# EAGLE design BL600CommunicationBoard (EAGLE 7.3.0)
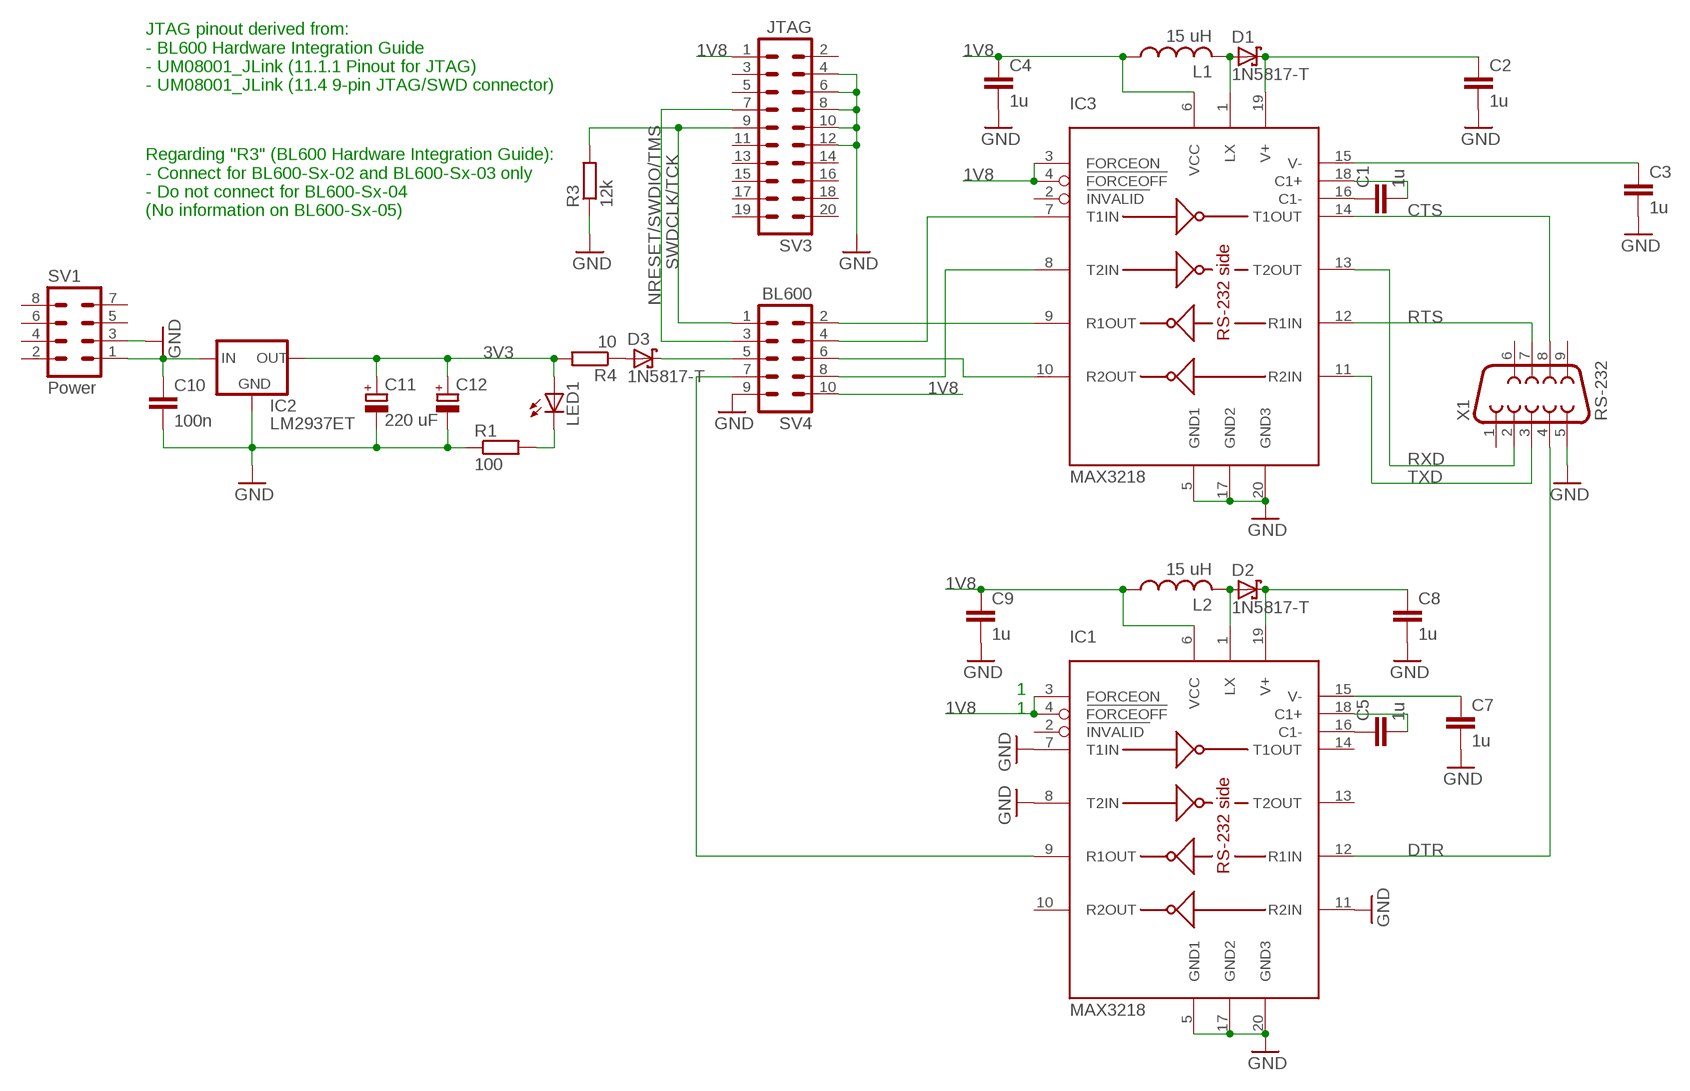
[diagram p0: schematic, sheet 1]

## Parts
C1  1u  C-EU050-025X075  [C050-025X075]
C2  1u  C-EU050-025X075  [C050-025X075]
C3  1u  C-EU050-025X075  [C050-025X075]
C4  1u  C-EU050-025X075  [C050-025X075]
C5  1u  C-EU050-025X075  [C050-025X075]
C7  1u  C-EU050-025X075  [C050-025X075]
C8  1u  C-EU050-025X075  [C050-025X075]
C9  1u  C-EU050-025X075  [C050-025X075]
C10  100n  C-EU050-025X075  [C050-025X075]
C11  220 uF  CPOL-EUE2.5-6  [E2,5-6]
C12  CPOL-EUE3.5-8  [E3,5-8]
D1  1N5817-T  [DO41-7.6]
D2  1N5817-T  [DO41-7.6]
D3  1N5817-T  [DO41-7.6]
IC1  MAX3218  [DIL20]
IC2  LM2937ET  78XXS  [78XXS]
IC3  MAX3218  [DIL20]
L1  15 uH  L-USL1812  [L1812]
L2  15 uH  L-USL1812  [L1812]
LED1  LED3MM  [LED3MM]
R1  100  R-EU_0207/10  [0207/10]
R3  12k  R-EU_0207/10  [0207/10]
R4  10  R-EU_0207/10  [0207/10]
SV1  Power  MA04-2  [MA04-2]
SV3  JTAG  MA10-2  [MA10-2]
SV4  BL600  MA05-2  [MA05-2]
X1  RS-232  F09VP  [F09VP]

## Nets
1V8: C4.1 C9.1 IC1.3(FORCEON) IC1.4(FORCEOFF) IC1.6(VCC) IC3.3(FORCEON) IC3.4(FORCEOFF) IC3.6(VCC) L1.1 L2.1 SV3.1 SV4.10
3V3: C11.+ C12.+ IC2.OUT LED1.A R4.2
CTS: IC3.14(T1OUT) X1.8
DTR: IC1.12(R1IN) X1.4
GND: C2.2 C3.2 C4.2 C7.2 C8.2 C9.2 C10.2 C11.- C12.- IC1.5(GND1) IC1.7(T1IN) IC1.8(T2IN) IC1.11(R2IN) IC1.17(GND2) IC1.20(GND3) IC2.GND IC3.5(GND1) IC3.17(GND2) IC3.20(GND3) R1.1 R3.1 SV1.3 SV3.4 SV3.6 SV3.8 SV3.10 SV3.12 SV4.9 X1.5
N$1: C10.1 IC2.IN SV1.1
N$2: IC3.8(T2IN) SV4.8
N$3: IC3.7(T1IN) SV4.4
N$4: IC3.9(R1OUT) SV4.2
N$5: IC3.10(R2OUT) SV4.6
N$6: D3.A R4.1
N$7: D3.C SV4.5
N$8: D1.A IC3.1(LX) L1.2
N$9: C2.1 D1.C IC3.19(V+)
N$10: C3.1 IC3.15(V-)
N$11: C1.1 IC3.16(C1-)
N$12: C1.2 IC3.18(C1+)
N$16: D2.A IC1.1(LX) L2.2
N$18: LED1.K(C) R1.2
N$19: C8.1 D2.C IC1.19(V+)
N$21: C5.1 IC1.16(C1-)
N$22: C5.2 IC1.18(C1+)
N$23: C7.1 IC1.15(V-)
N$24: IC1.9(R1OUT) SV4.7
NRESET/SWDIO/TMS: SV3.7 SV4.3
RTS: IC3.12(R1IN) X1.7
RXD: IC3.13(T2OUT) X1.2
SWDCLK/TCK: R3.2 SV3.9 SV4.1
TXD: IC3.11(R2IN) X1.3
Unconnected: IC1.2(INVALID) IC1.10(R2OUT) IC1.13(T2OUT) IC1.14(T1OUT) IC3.2(INVALID) SV1.2 SV1.4 SV1.5 SV1.6 SV1.7 SV1.8 SV3.2 SV3.3 SV3.5 SV3.11 SV3.13 SV3.14 SV3.15 SV3.16 SV3.17 SV3.18 SV3.19 SV3.20 X1.1 X1.6 X1.9

## Notes on the sheet
- JTAG pinout derived from:
  - BL600 Hardware Integration Guide
  - UM08001_JLink (11.1.1 Pinout for JTAG)
  - UM08001_JLink (11.4 9-pin JTAG/SWD connector)
- Regarding "R3" (BL600 Hardware Integration Guide):
  - Connect for BL600-Sx-02 and BL600-Sx-03 only
  - Do not connect for BL600-Sx-04
  (No information on BL600-Sx-05)
- 1
  1

## Library data of the parts
C1-C5 C7-C10 = rcl:C-EU: CAPACITOR, European symbol
C11 C12 = rcl:CPOL-EU: POLARIZED CAPACITOR, European symbol
D1-D3 = diode:1N581*: 1.0A SCHOTTKY BARRIER RECTIFIER Source: http://www.diodes.com/datasheets/ds23001.pdf
IC1 IC3 = ulf:MAX3218
IC2 = v-reg:78XXS: VOLTAGE REGULATOR
L1 L2 = rcl:L-US: INDUCTOR, American symbol
LED1 = led:LED: LED OSRAM: - CHIPLED LG R971, LG N971, LY N971, LG Q971, LY Q971, LO R971, LY R971 LH N974, LH R974 LS Q976, LO Q976, LY Q976 LO Q996 - Hyper CHIPLED LW Q18S LB Q993, LB Q99A, LB R99A - SideLED LS A670, LO A670, LY A670, LG A670, LP A670 LB A673, LV A673, LT A673, LW A673 LH A674 LY A675 LS A676, LA A676, LO A676, LY A676, LW A676 LS A679, LY A679, LG A679 - Hyper Micro SIDELED® LS Y876, LA Y876, LO Y876, LY Y876 LT Y87S - SmartLED LW L88C, LW L88S LB L89C, LB L89S, LG L890 LS L89K, LO L89K, LY L89K LS L896, LA L896, LO L896, LY L896 - TOPLED LS T670, LO T670, LY T670, LG T670, LP T670 LSG T670, LSP T670, LSY T670, LOP T670, LYG T670 LG T671, LOG T671, LSG T671 LB T673, LV T673, LT T673, LW T673 LH T674 LS T676, LA T676, LO T676, LY T676, LB T676, LH T676, LSB T676, LW T676 LB T67C, LV T67C, LT T67C, LS T67K, LO T67K, LY T67K, LW E67C LS E67B, LA E67B, LO E67B, LY E67B, LB E67C, LV E67C, LT E67C LW T67C LS T679, LY T679, LG T679 LS T770, LO T770, LY T770, LG T770, LP T770 LB T773, LV T773, LT T773, LW T773 LH T774 LS E675, LA E675, LY E675, LS T675 LS T776, LA T776, LO T776, LY T776, LB T776 LHGB T686 LT T68C, LB T68C - Hyper Mini TOPLED® LB M676 - Mini TOPLED Santana® LG M470 LS M47K, LO M47K, LY M47K Source: http://www.osram.convergy.de LUXEON: - LUMILED® LXK2-PW12-R00, LXK2-PW12-S00, LXK2-PW14-U00, LXK2-PW14-V00 LXK2-PM12-R00, LXK2-PM12-S00, LXK2-PM14-U00 LXK2-PE12-Q00, LXK2-PE12-R00, LXK2-PE12-S00, LXK2-PE14-T00, LXK2-PE14-U00 LXK2-PB12-K00, LXK2-PB12-L00, LXK2-PB12-M00, LXK2-PB14-N00, LXK2-PB14-P00, LXK2-PB14-Q00 LXK2-PR12-L00, LXK2-PR12-M00, LXK2-PR14-Q00, LXK2-PR14-R00 LXK2-PD12-Q00, LXK2-PD12-R00, LXK2-PD12-S00 LXK2-PH12-R00, LXK2-PH12-S00 LXK2-PL12-P00, LXK2-PL12-Q00, LXK2-PL12-R00 Source: www.luxeon.com KINGBRIGHT: KA-3528ASYC Source: www.kingbright.com
R1 R3 R4 = rcl:R-EU_: RESISTOR, European symbol
SV1 = con-lstb:MA04-2: PIN HEADER; OC_FARNELL: unknown; OC_NEWARK: unknown
SV3 = con-lstb:MA10-2: PIN HEADER; OC_FARNELL: unknown; OC_NEWARK: unknown
SV4 = con-lstb:MA05-2: PIN HEADER; OC_FARNELL: unknown; OC_NEWARK: unknown
X1 = con-subd:F09: SUB-D; OC_FARNELL: unknown; OC_NEWARK: unknown

## Board
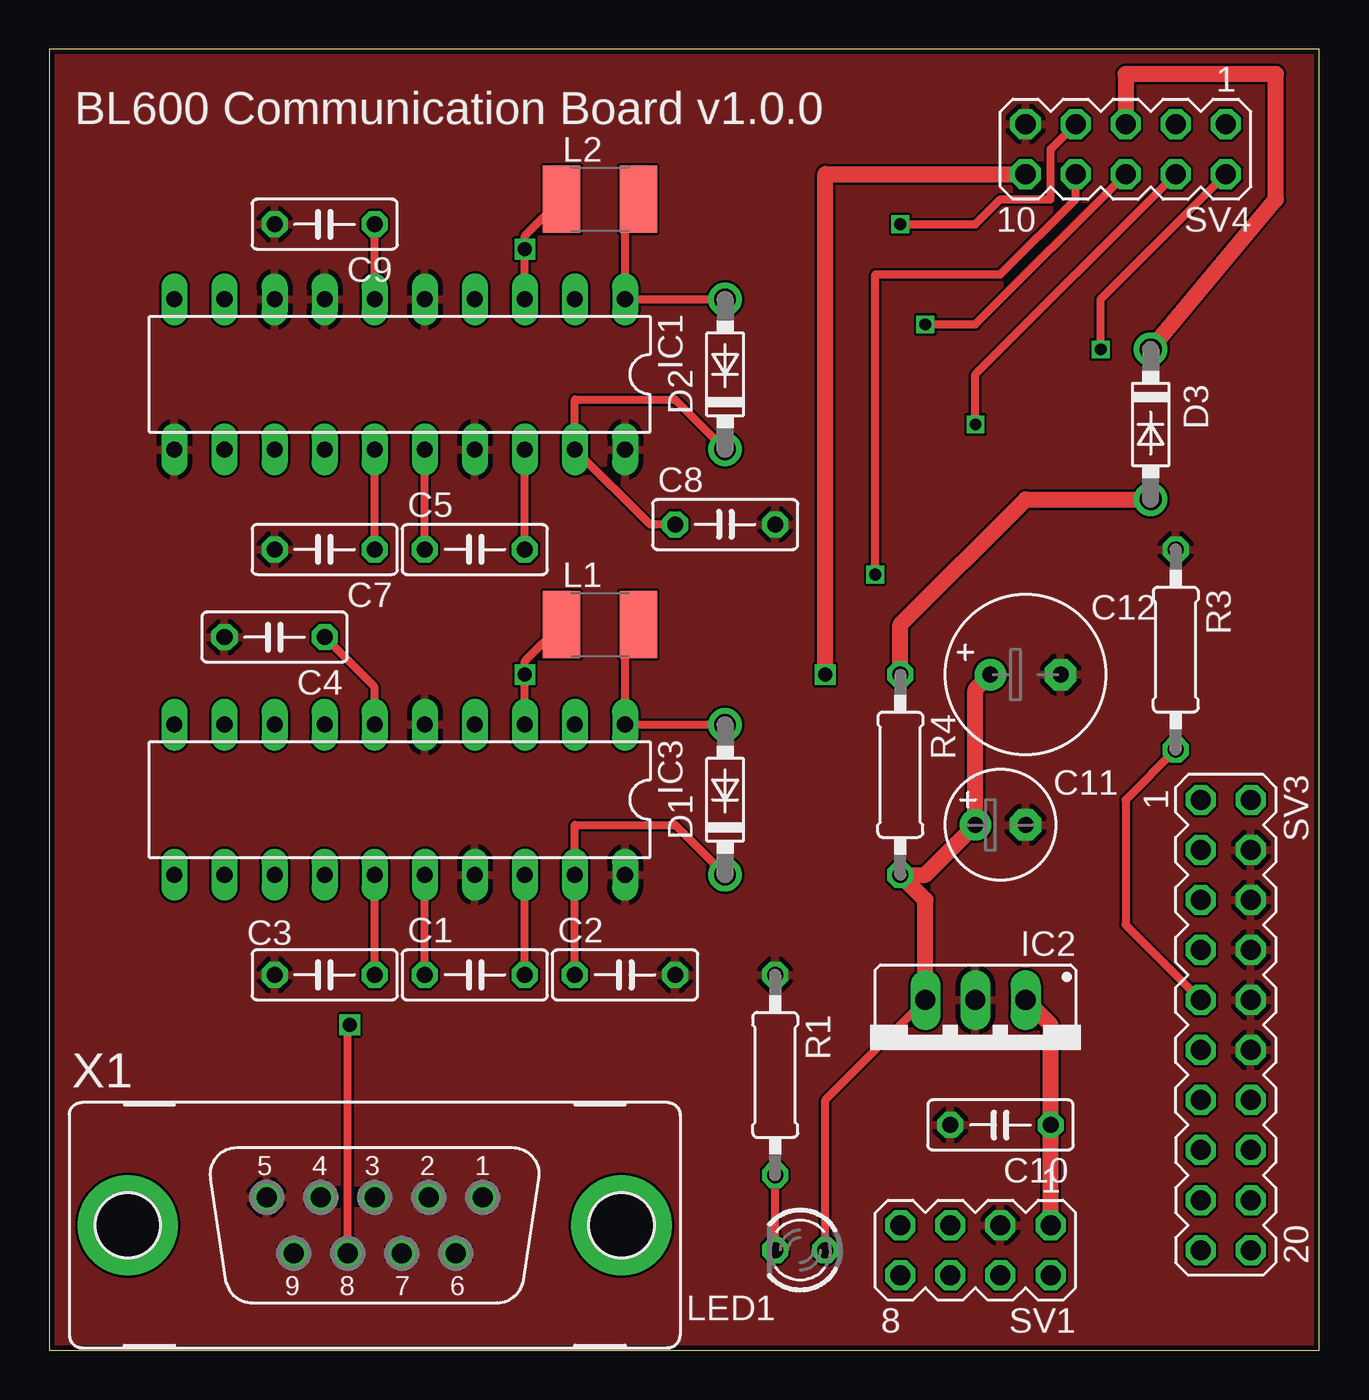
[diagram p1: board, top side]
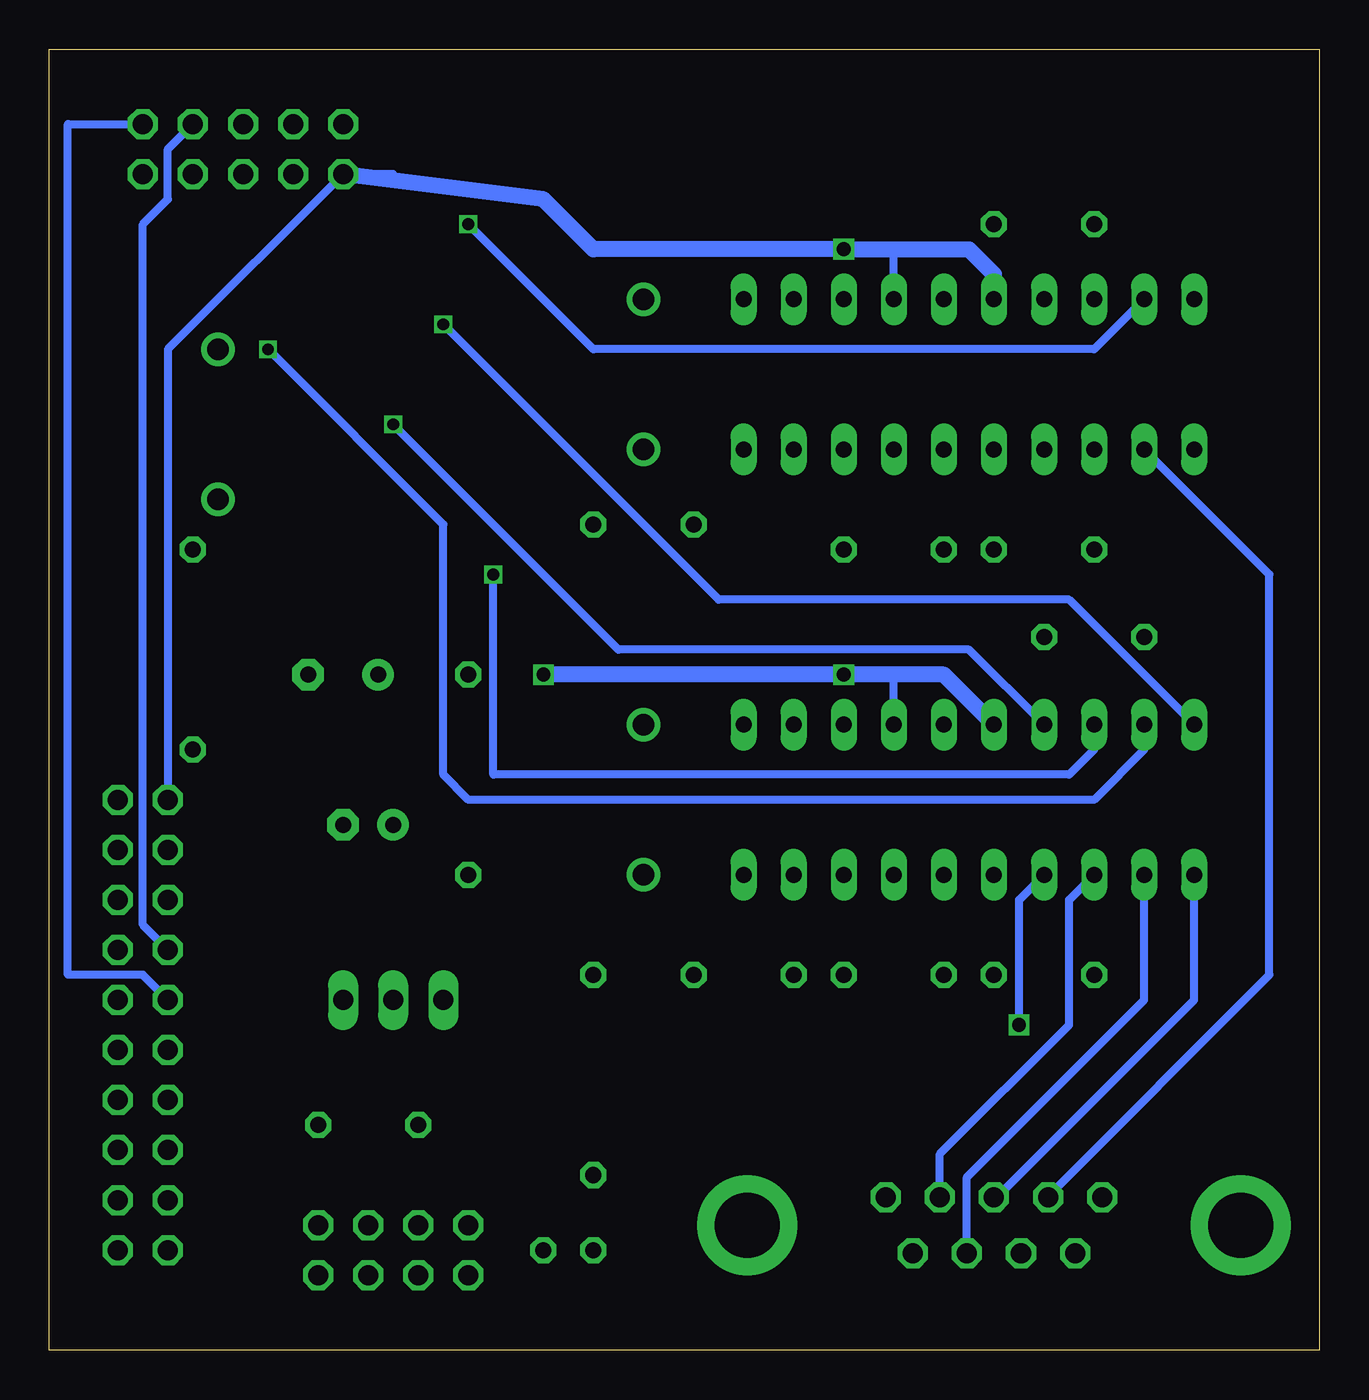
[diagram p2: board, bottom side, seen from below]

Size 64.44 x 66.03 mm. Coordinates in mm from the lower left corner, seen from the top.
Outline: 0,0 64.44,0 64.44,66.03 0,66.03 0,0
Copper layers (1*16): Top 0.035mm / dielectric 1.5mm / Bottom 0.035mm
Design rules "dirt_cheap_dirty_boards.v1": minimum track width 5mil, minimum drill 12mil, track to track 5mil, track to pad 5mil, pad to pad 5mil, via to via 5mil, smd to smd 0mil, copper to edge 10mil, drill to drill 10mil, minimum pad ring 10mil, minimum via ring 6mil, stop-mask expansion 2mil, vias tented up to drill 25mil, thermal gap 10mil

### Footprints (pad centres in the part's own frame; a part is rotated, then mirrored left to right if it is on the bottom)
C050-025X075 = drill 0.813 octagon: 1 -2.54,0; 2 2.54,0
E2,5-6 = drill 0.813 pad 1.6: + -1.27,0 | drill 0.813 pad 1.6 octagon: - 1.27,0
E3,5-8 = drill 0.813 pad 1.6: + -1.778,0 | drill 0.813 pad 1.6 octagon: - 1.778,0
DO41-7.6 = drill 1.1 pad 1.7: A 3.81,0; C -3.81,0
DIL20 = drill 0.813 long: 1 -11.43,-3.81; 2 -8.89,-3.81; 3 -6.35,-3.81; 4 -3.81,-3.81; 5 -1.27,-3.81; 6 1.27,-3.81; 7 3.81,-3.81; 8 6.35,-3.81; 9 8.89,-3.81; 10 11.43,-3.81; 11 11.43,3.81; 12 8.89,3.81; 13 6.35,3.81; 14 3.81,3.81; 15 1.27,3.81; 16 -1.27,3.81; 17 -3.81,3.81; 18 -6.35,3.81; 19 -8.89,3.81; 20 -11.43,3.81
78XXS = drill 1.016 long: GND 0,-2.54; IN -2.54,-2.54; OUT 2.54,-2.54
L1812 = smd 1.9 x 3.4: 1 -1.95,0; 2 1.95,0
LED3MM = drill 0.813 octagon: A -1.27,0; K 1.27,0
0207/10 = drill 0.813 octagon: 1 -5.08,0; 2 5.08,0
MA04-2 = drill 1.016 octagon: 1 -3.81,-1.27; 2 -3.81,1.27; 3 -1.27,-1.27; 4 -1.27,1.27; 5 1.27,-1.27; 6 1.27,1.27; 7 3.81,-1.27; 8 3.81,1.27
MA10-2 = drill 1.016 octagon: 1 -11.43,-1.27; 2 -11.43,1.27; 3 -8.89,-1.27; 4 -8.89,1.27; 5 -6.35,-1.27; 6 -6.35,1.27; 7 -3.81,-1.27; 8 -3.81,1.27; 9 -1.27,-1.27; 10 -1.27,1.27; 11 1.27,-1.27; 12 1.27,1.27; 13 3.81,-1.27; 14 3.81,1.27; 15 6.35,-1.27; 16 6.35,1.27; 17 8.89,-1.27; 18 8.89,1.27; 19 11.43,-1.27; 20 11.43,1.27
MA05-2 = drill 1.016 octagon: 1 -5.08,-1.27; 2 -5.08,1.27; 3 -2.54,-1.27; 4 -2.54,1.27; 5 0,-1.27; 6 0,1.27; 7 2.54,-1.27; 8 2.54,1.27; 9 5.08,-1.27; 10 5.08,1.27
F09VP = drill 1.016 octagon: 1 5.486,1.422; 2 2.743,1.422; 3 0,1.422; 4 -2.743,1.422; 5 -5.486,1.422; 6 4.115,-1.422; 7 1.372,-1.422; 8 -1.372,-1.422; 9 -4.115,-1.422 | drill 3.302 pad 5.08: G1 -12.522,0; G2 12.522,0

### Placement (x,y rotation side)
C1  21.59,19.05 0 top
C2  29.21,19.05 0 top
C3  13.97,19.05 180 top
C4  11.43,36.2 180 top
C5  21.59,40.64 0 top
C7  13.97,40.64 180 top
C8  34.29,41.91 0 top
C9  13.97,57.15 180 top
C10  48.26,11.43 180 top
C11  48.26,26.67 0 top
C12  49.53,34.29 0 top
D1  34.29,27.94 90 top
D2  34.29,49.53 90 top
D3  55.88,46.99 270 top
IC1  17.78,49.53 180 top
IC2  46.99,15.24 180 top
IC3  17.78,27.94 180 top
L1  27.94,36.83 0 top
L2  27.94,58.42 0 top
LED1  38.1,5.08 180 top
R1  36.83,13.97 270 top
R3  57.15,35.56 270 top
R4  43.18,29.21 270 top
SV1  46.99,5.08 180 top
SV3  59.69,16.51 270 top
SV4  54.61,60.96 180 top
X1  16.51,6.35 0 top

### Tracks (layer width: path | path; a pad name or v marks a point on that pad's centre or on a via)
1V8  (via drill 0.7)
  Top 0.406: IC3.3 v24.13,34.29 24.13,34.97 L1.1 | IC3.6 16.51,33.66 C4.1 | IC1.6 C9.1 | IC1.3 v24.13,55.88 24.13,56.56 L2.1
  Top 0.813: v39.37,34.29 39.37,59.69 SV4.10
  Bottom 0.406: 46.99,59.69 SV4.10 58.42,50.8 SV3.1 | IC3.4 21.59,34.29 | IC1.4 21.59,55.88
  Bottom 0.813: IC1.6 16.51,54.61 17.78,55.88 21.59,55.88 v24.13,55.88 36.83,55.88 39.37,58.42 SV4.10 | IC3.6 19.05,34.29 21.59,34.29 v24.13,34.29 v39.37,34.29
3V3
  Top 0.406: LED1.A 39.37,12.7 IC2.OUT
  Top 0.813: IC2.OUT 44.45,22.86 R4.2 44.45,24.13 C11.+ 46.99,33.53 C12.+
CTS  (via drill 0.7)
  Top 0.406: X1.8 15.14,16.41 v15.24,16.51
  Bottom 0.406: v15.24,16.51 15.24,22.86 IC3.14
DTR
  Bottom 0.406: X1.4 13.77,7.82 2.54,19.05 2.54,39.37 IC1.12
GND
  pour Top: 0,66.04 64.77,66.04 64.77,0 0,0
N$1
  Top 0.813: SV1.1 C10.1 50.8,16.51 IC2.IN
N$2  (via drill 0.6)
  Top 0.406: v41.91,39.37 41.91,54.61 48.26,54.61 52.07,58.42 SV4.8
  Bottom 0.406: IC3.8 11.43,30.48 12.7,29.21 41.91,29.21 v41.91,39.37
N$3  (via drill 0.6)
  Top 0.406: v46.99,46.99 46.99,49.53 SV4.4
  Bottom 0.406: IC3.7 17.78,35.56 35.56,35.56 v46.99,46.99
N$4  (via drill 0.6)
  Top 0.406: v53.34,50.8 53.34,53.34 SV4.2
  Bottom 0.406: IC3.9 8.89,30.48 11.43,27.94 43.18,27.94 44.45,29.21 44.45,41.91 v53.34,50.8
N$5  (via drill 0.6)
  Top 0.406: v44.45,52.07 46.99,52.07 SV4.6
  Bottom 0.406: IC3.10 12.7,38.1 30.48,38.1 v44.45,52.07
N$6
  Top 0.813: R4.1 43.18,36.83 49.53,43.18 D3.A
N$7
  Top 0.813: D3.C 62.23,58.42 62.23,64.77 54.61,64.77 SV4.5
N$8
  Top 0.406: D1.A IC3.1 29.21,36.15 L1.2
N$9
  Top 0.406: C2.1 IC3.19 26.67,26.67 31.75,26.67 D1.C
N$10
  Top 0.406: C3.1 IC3.15
N$11
  Top 0.406: C1.1 IC3.16
N$12
  Top 0.406: C1.2 IC3.18
N$16
  Top 0.406: L2.2 29.21,57.74 IC1.1 D2.A
N$18
  Top 0.406: LED1.K R1.2
N$19
  Top 0.406: D2.C 31.75,48.26 26.67,48.26 IC1.19 30.48,41.91 C8.1
N$21
  Top 0.406: C5.1 IC1.16
N$22
  Top 0.406: C5.2 IC1.18
N$23
  Top 0.406: C7.1 IC1.15
N$24  (via drill 0.6)
  Top 0.406: v43.18,57.15 46.99,57.15 48.26,58.42 50.8,58.42 50.8,60.96 SV4.7
  Bottom 0.406: IC1.9 11.43,50.8 36.83,50.8 v43.18,57.15
NRESET/SWDIO/TMS
  Bottom 0.406: SV3.7 59.69,21.59 59.69,57.15 58.42,58.42 58.42,60.96 SV4.3
RTS
  Bottom 0.406: X1.7 17.88,8.79 8.89,17.78 IC3.12
RXD
  Bottom 0.406: X1.2 19.25,9.96 12.7,16.51 12.7,22.86 IC3.13
SWDCLK/TCK
  Top 0.406: R3.2 54.61,27.94 54.61,21.59 SV3.9
  Bottom 0.406: SV3.9 59.69,19.05 63.5,19.05 63.5,62.23 SV4.1
TXD
  Bottom 0.406: X1.3 16.36,7.77 6.35,17.78 IC3.11

### Text on the board
tPlace: BL600 Communication Board v1.0.0